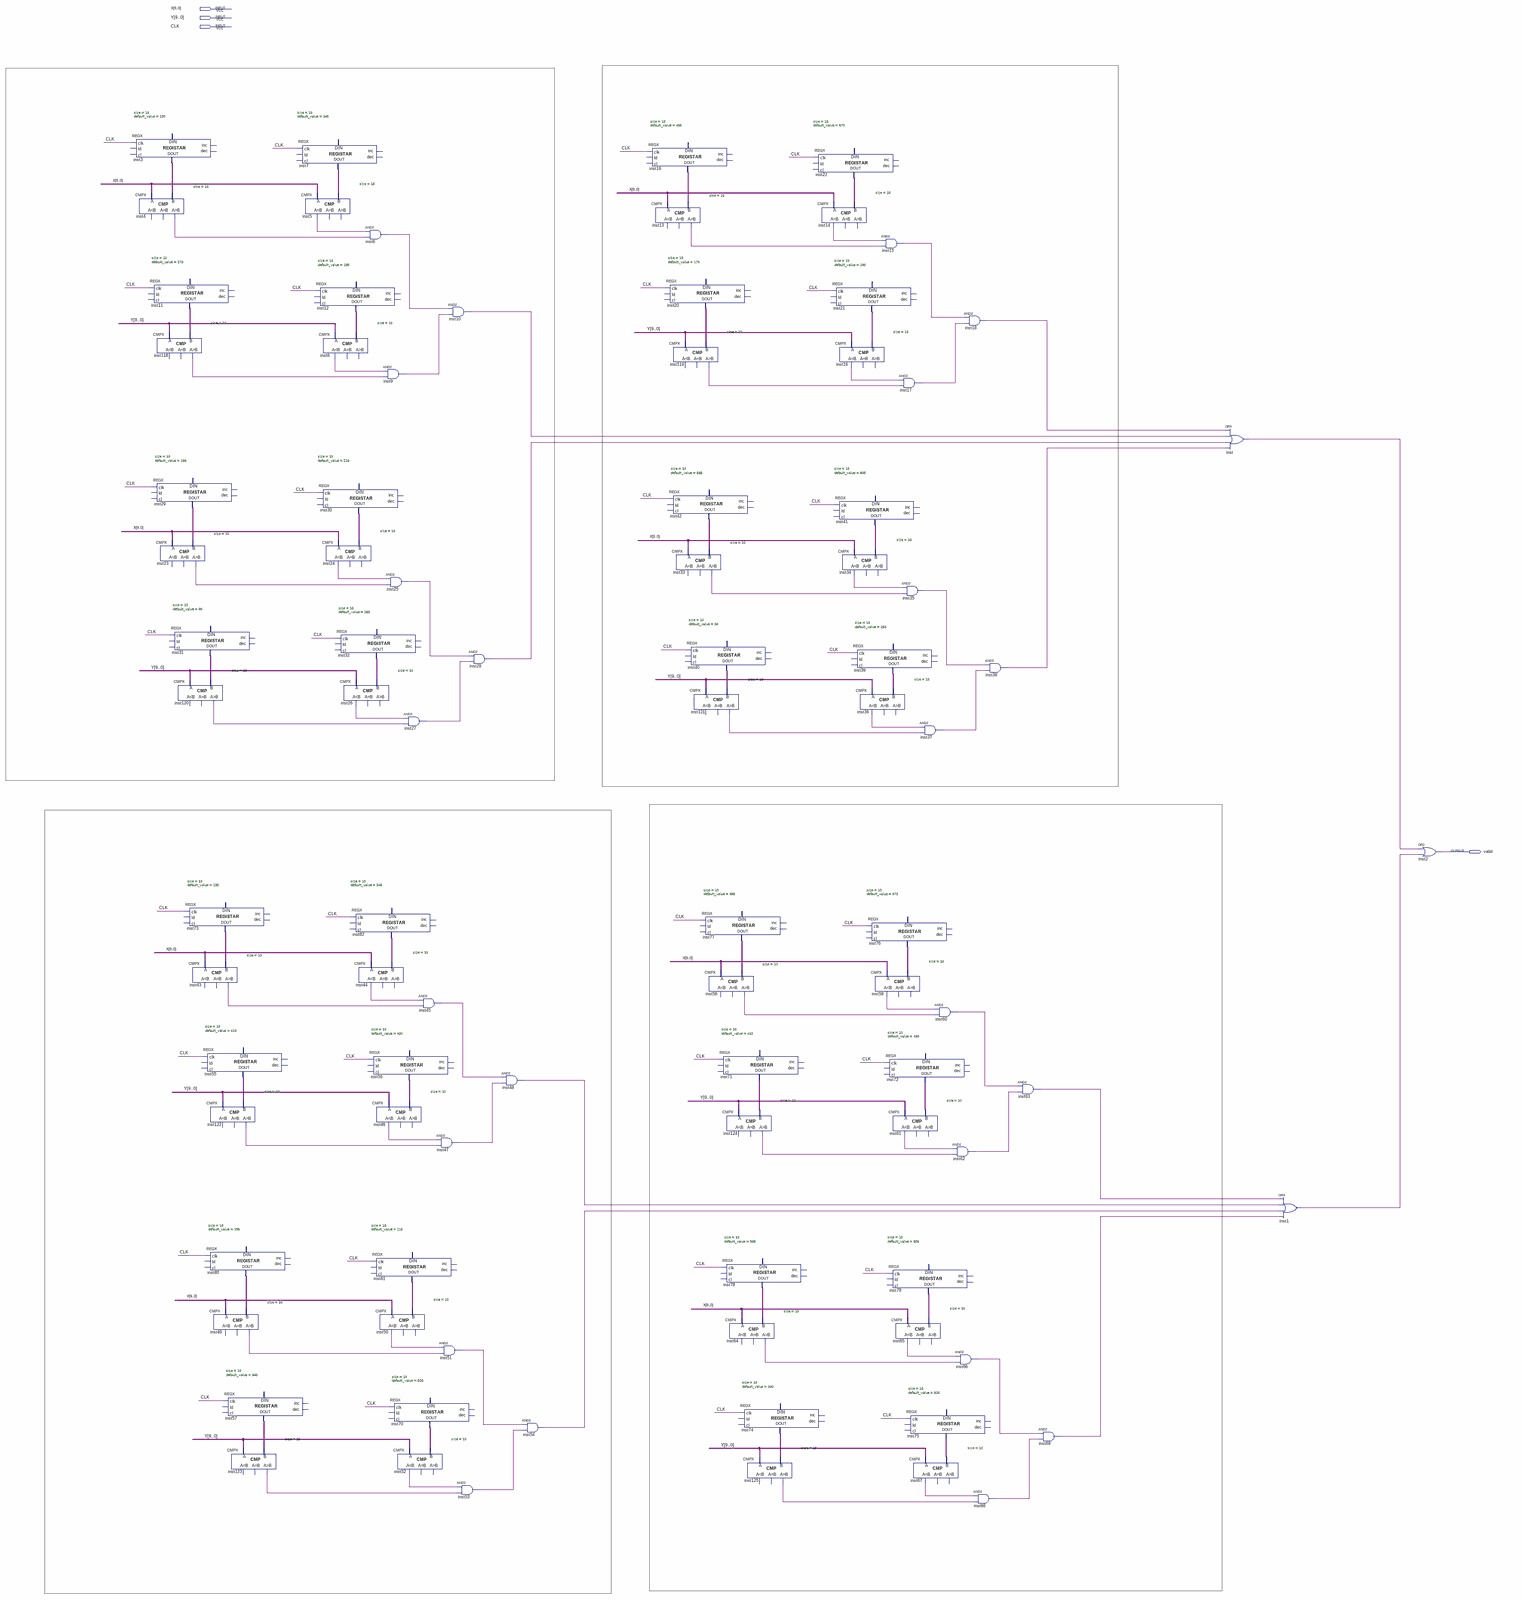
[diagram p0: schematic sheet, whole]
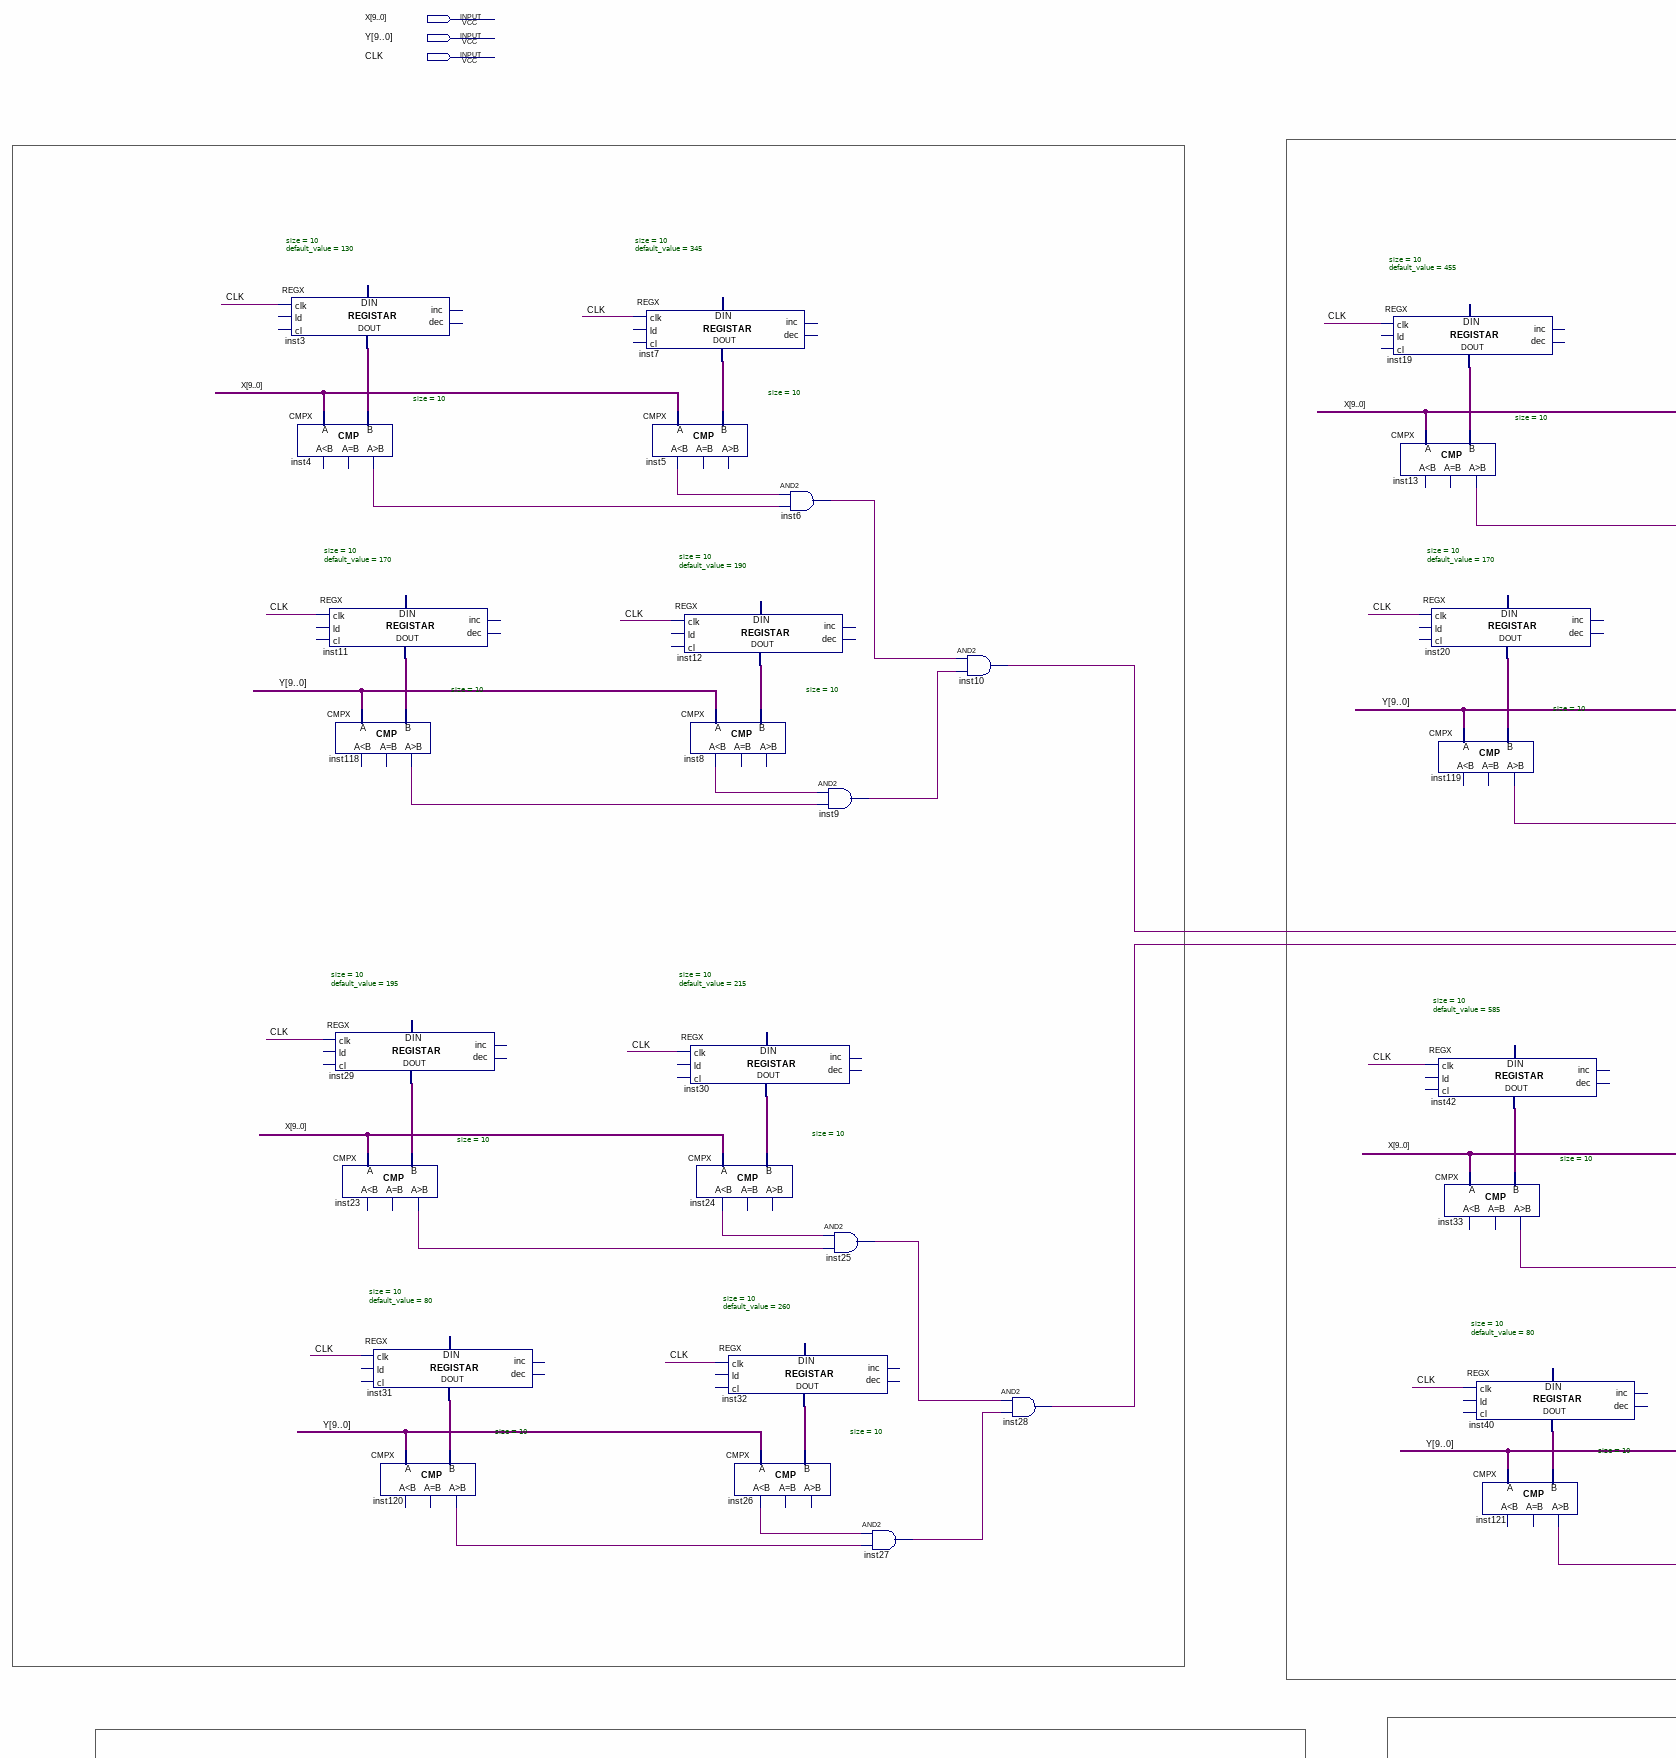
[diagram p1: schematic sheet, upper left part]
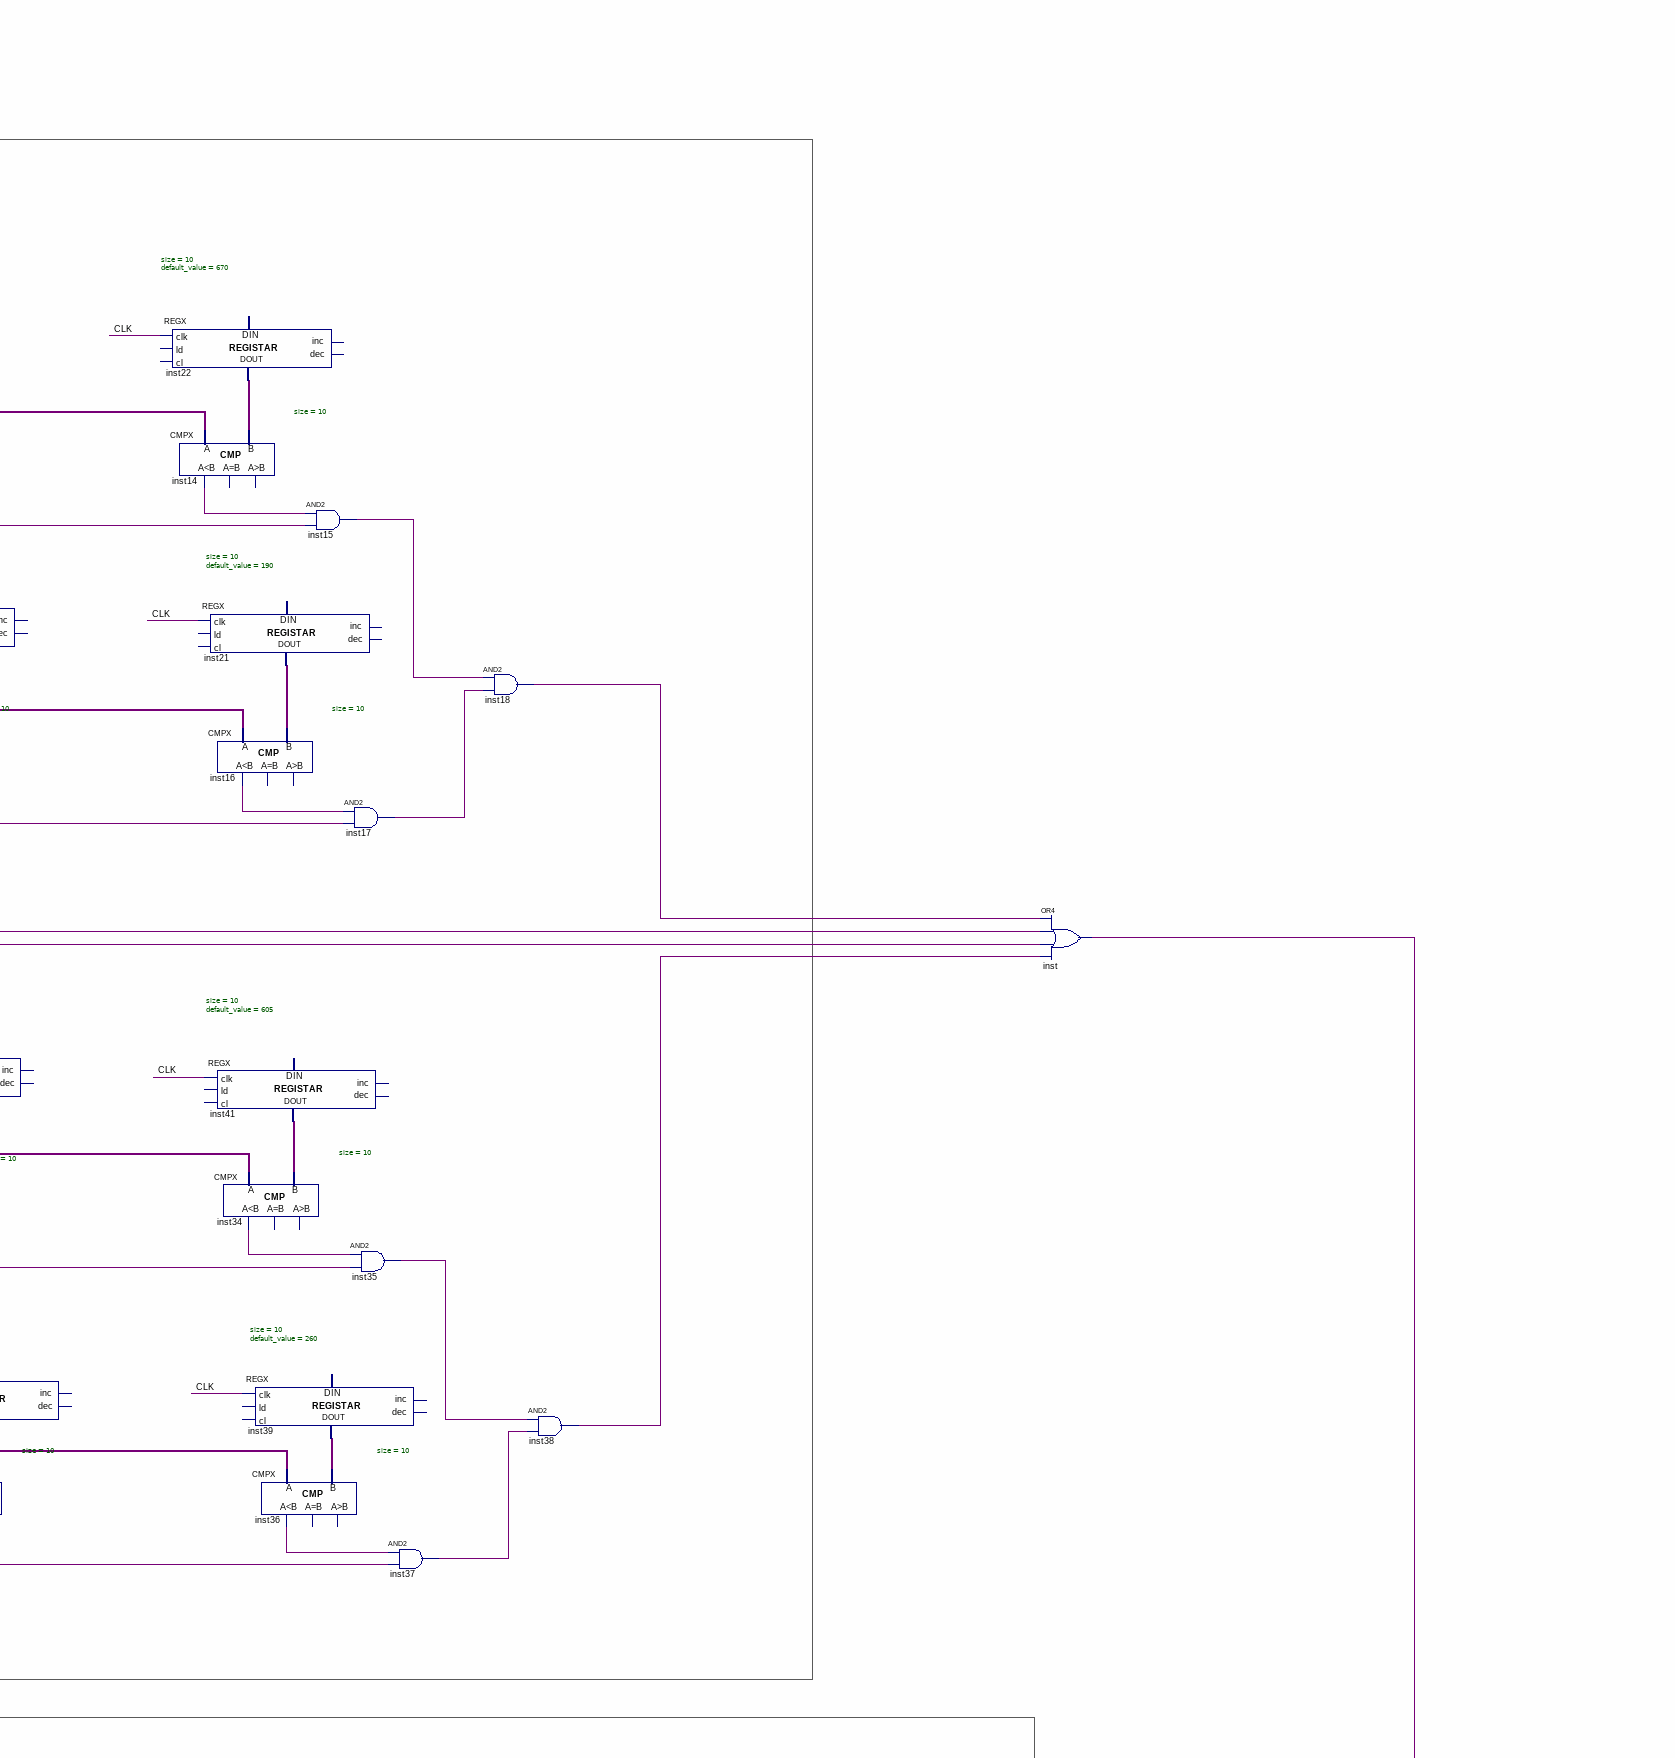
[diagram p2: schematic sheet, upper right part]
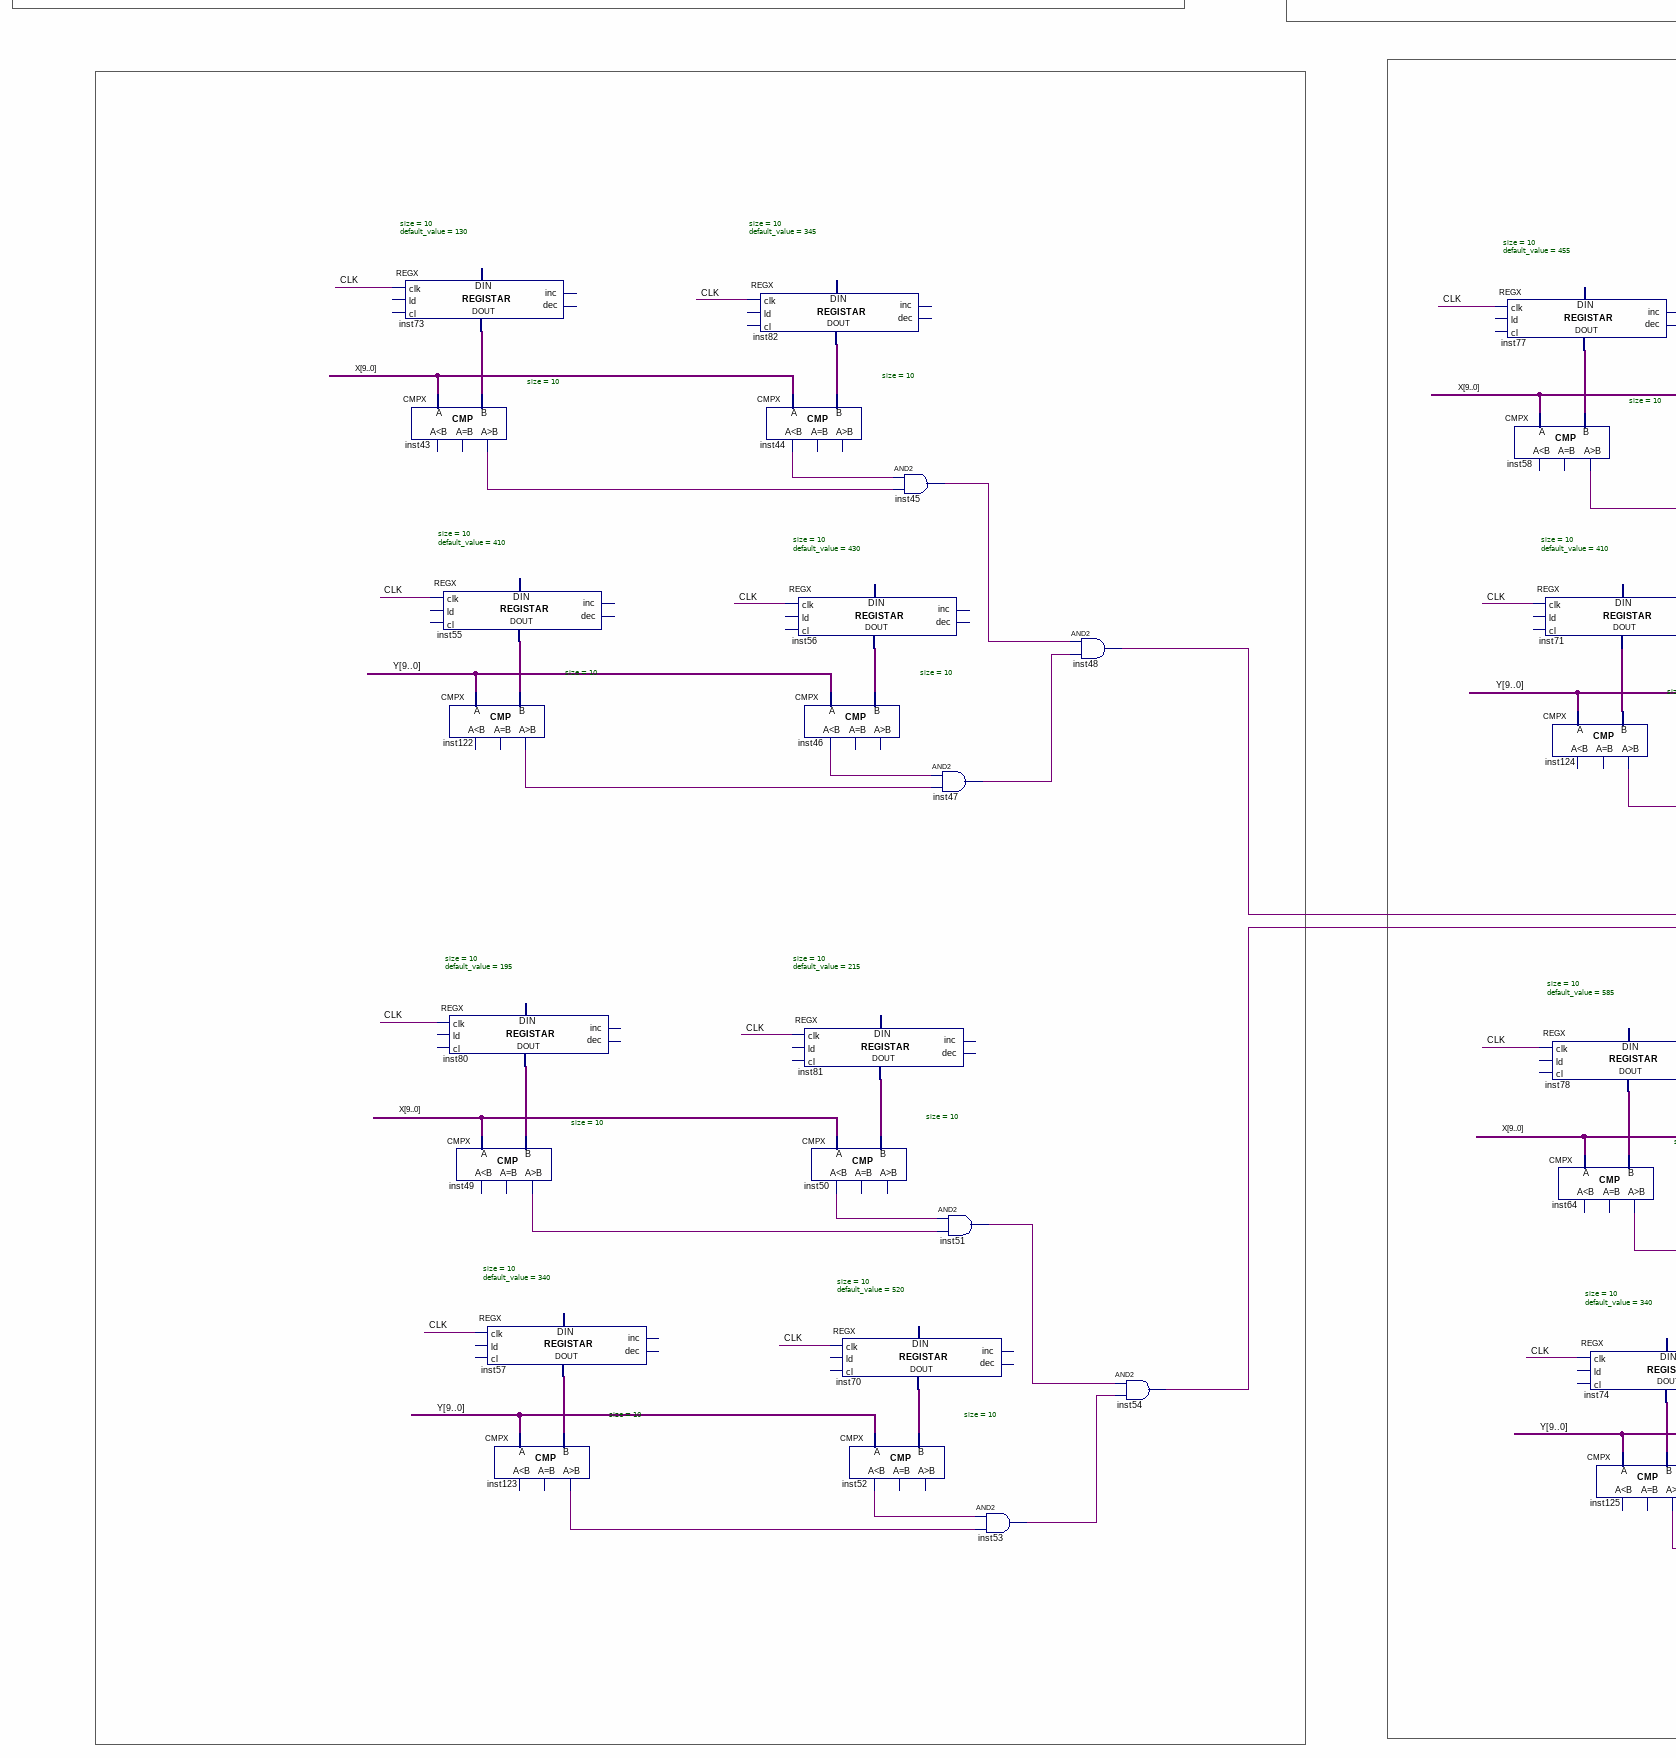
[diagram p3: schematic sheet, lower left part]
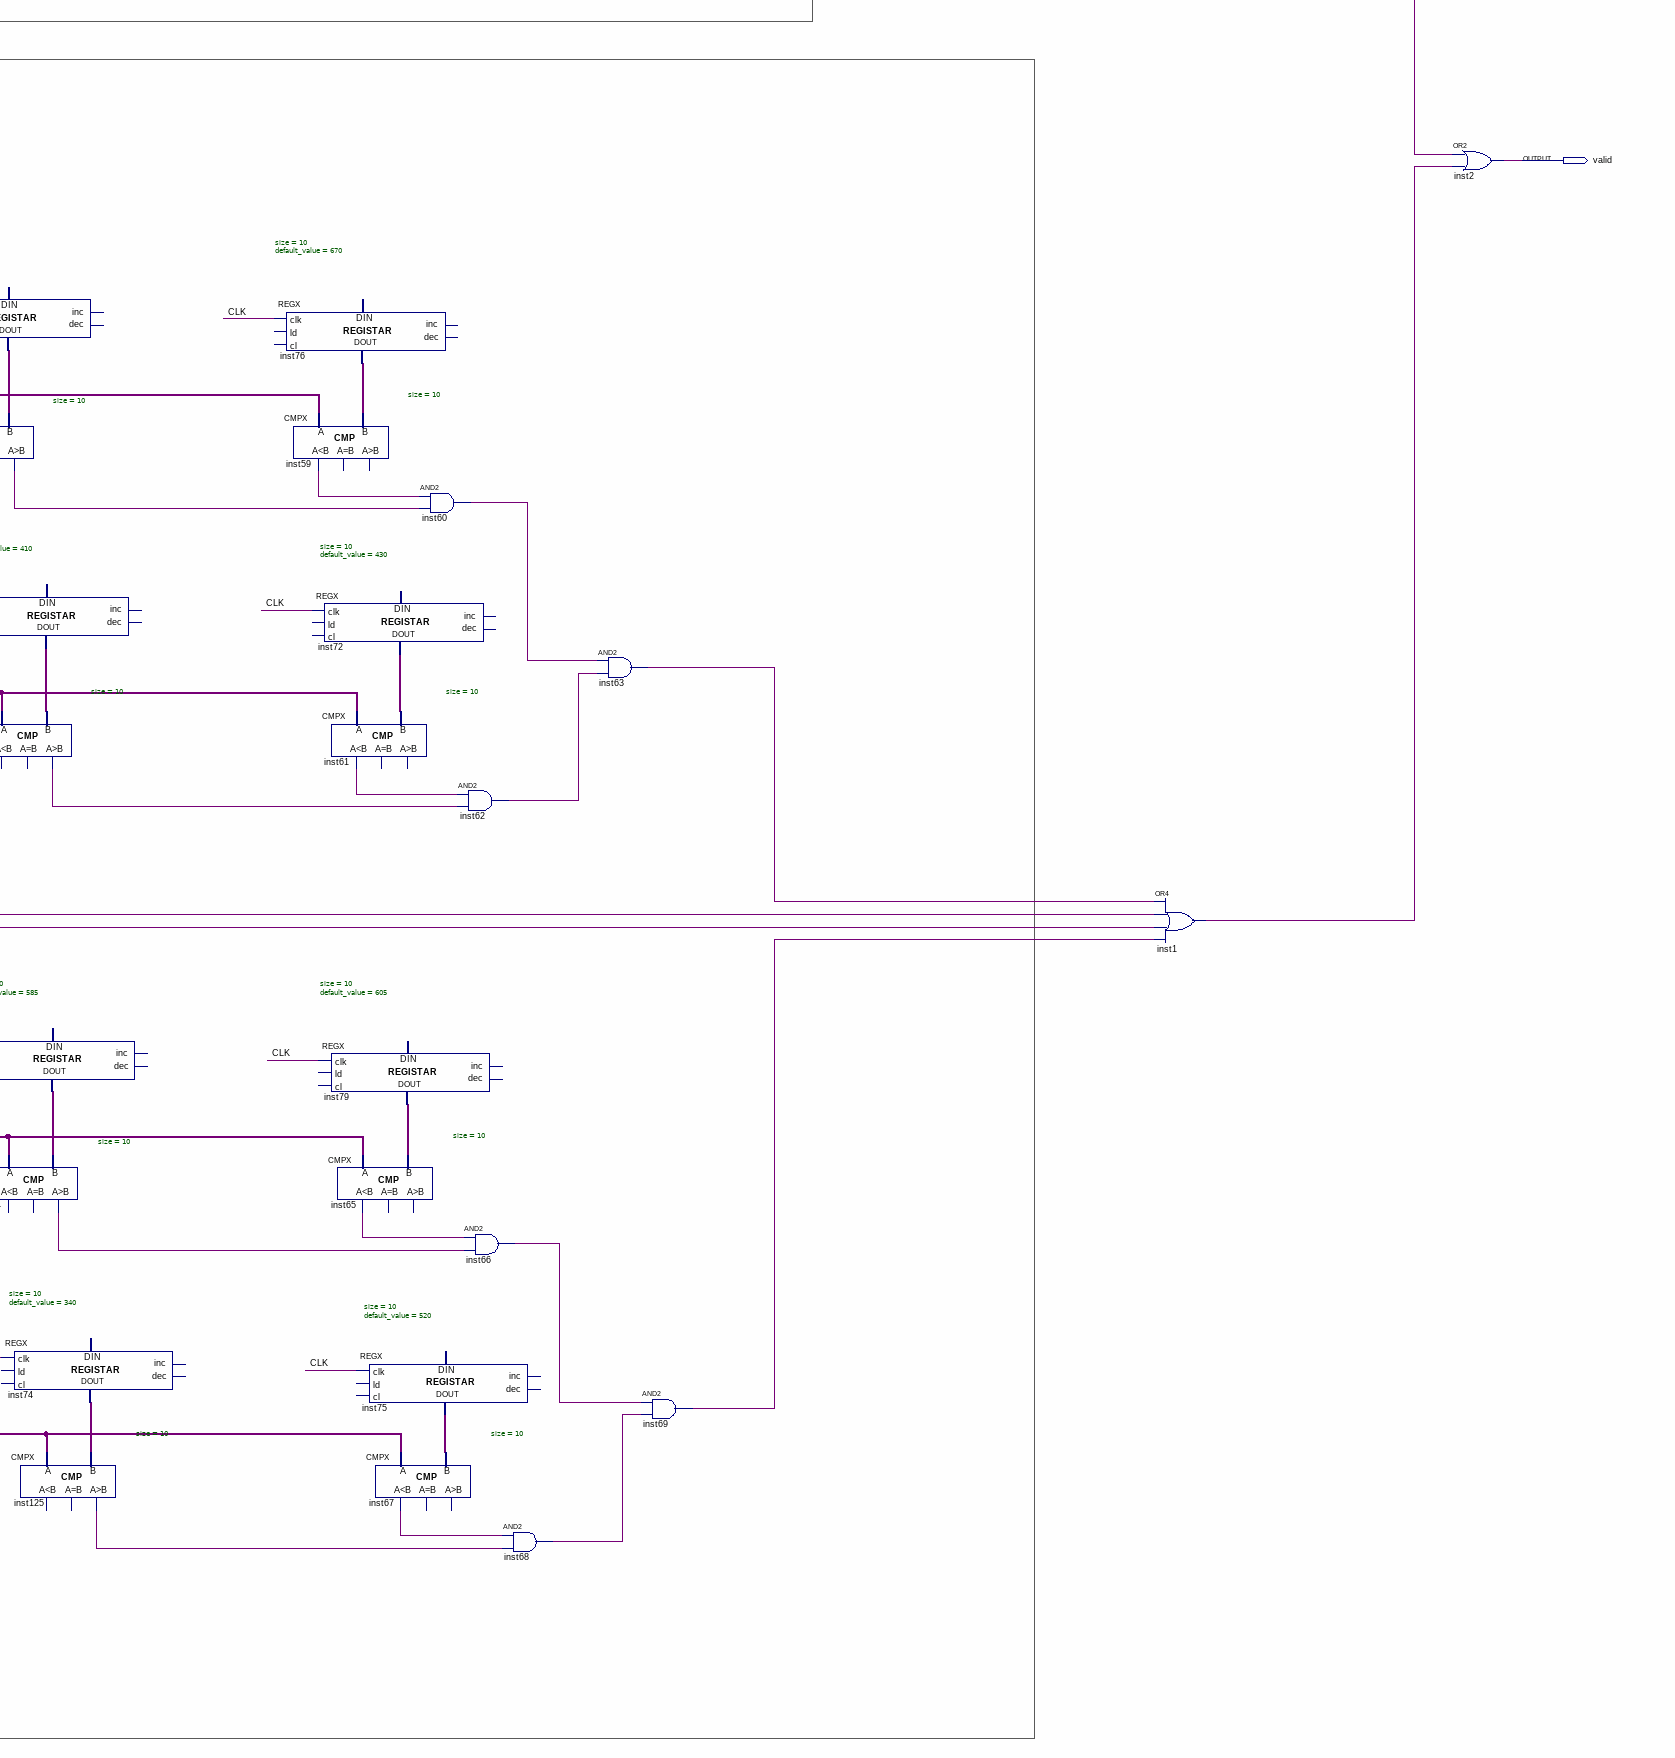
[diagram p4: schematic sheet, lower right part]
// Quartus schematic krst.bdf as structural Verilog: 91 symbols, 4 pins
module krst (
  input  [9:0] X,
  input  [9:0] Y,
  input  CLK,
  output valid
);

  wire inst1_out, inst4_gr, inst5_ls, inst6_out, inst8_ls, inst9_out, inst10_out, inst13_gr, inst14_ls,
       inst15_out, inst16_ls, inst17_out, inst18_out, inst23_gr, inst24_ls, inst25_out, inst26_ls,
       inst27_out, inst28_out, inst33_gr, inst34_ls, inst35_out, inst36_ls, inst37_out, inst38_out,
       inst43_gr, inst44_ls, inst45_out, inst46_ls, inst47_out, inst48_out, inst49_gr, inst50_ls, inst51_out,
       inst52_ls, inst53_out, inst54_out, inst58_gr, inst59_ls, inst60_out, inst61_ls, inst62_out,
       inst63_out, inst64_gr, inst65_ls, inst66_out, inst67_ls, inst68_out, inst69_out, inst118_gr,
       inst119_gr, inst120_gr, inst121_gr, inst122_gr, inst123_gr, inst124_gr, inst125_gr, inst_out;
  wire [9:0] inst3_data_out, inst7_data_out, inst11_data_out, inst12_data_out, inst19_data_out,
       inst20_data_out, inst21_data_out, inst22_data_out, inst29_data_out, inst30_data_out, inst31_data_out,
       inst32_data_out, inst39_data_out, inst40_data_out, inst41_data_out, inst42_data_out, inst55_data_out,
       inst56_data_out, inst57_data_out, inst70_data_out, inst71_data_out, inst72_data_out, inst73_data_out,
       inst74_data_out, inst75_data_out, inst76_data_out, inst77_data_out, inst78_data_out, inst79_data_out,
       inst80_data_out, inst81_data_out, inst82_data_out;

  REGX #(.size(10), .default_value(130)) inst3 (
    .clk(CLK), .data_out(inst3_data_out));  // open: ld, cl, inc, dec, data_in
  CMPX #(.size(10)) inst4 (.A(X), .B(inst3_data_out), .gr(inst4_gr));  // open: ls, eq
  REGX #(.size(10), .default_value(170)) inst11 (
    .clk(CLK), .data_out(inst11_data_out));  // open: ld, cl, inc, dec, data_in
  CMPX #(.size(10)) inst118 (.A(Y), .B(inst11_data_out), .gr(inst118_gr));  // open: ls, eq
  REGX #(.size(10), .default_value(195)) inst29 (
    .clk(CLK), .data_out(inst29_data_out));  // open: ld, cl, inc, dec, data_in
  CMPX #(.size(10)) inst23 (.A(X), .B(inst29_data_out), .gr(inst23_gr));  // open: ls, eq
  REGX #(.size(10), .default_value(80)) inst31 (
    .clk(CLK), .data_out(inst31_data_out));  // open: ld, cl, inc, dec, data_in
  CMPX #(.size(10)) inst120 (.A(Y), .B(inst31_data_out), .gr(inst120_gr));  // open: ls, eq
  REGX #(.size(10), .default_value(130)) inst73 (
    .clk(CLK), .data_out(inst73_data_out));  // open: ld, cl, inc, dec, data_in
  CMPX #(.size(10)) inst43 (.A(X), .B(inst73_data_out), .gr(inst43_gr));  // open: ls, eq
  REGX #(.size(10), .default_value(410)) inst55 (
    .clk(CLK), .data_out(inst55_data_out));  // open: ld, cl, inc, dec, data_in
  CMPX #(.size(10)) inst122 (.A(Y), .B(inst55_data_out), .gr(inst122_gr));  // open: ls, eq
  REGX #(.size(10), .default_value(195)) inst80 (
    .clk(CLK), .data_out(inst80_data_out));  // open: ld, cl, inc, dec, data_in
  CMPX #(.size(10)) inst49 (.A(X), .B(inst80_data_out), .gr(inst49_gr));  // open: ls, eq
  REGX #(.size(10), .default_value(340)) inst57 (
    .clk(CLK), .data_out(inst57_data_out));  // open: ld, cl, inc, dec, data_in
  CMPX #(.size(10)) inst123 (.A(Y), .B(inst57_data_out), .gr(inst123_gr));  // open: ls, eq
  REGX #(.size(10), .default_value(345)) inst7 (
    .clk(CLK), .data_out(inst7_data_out));  // open: ld, cl, inc, dec, data_in
  CMPX #(.size(10)) inst5 (.A(X), .B(inst7_data_out), .ls(inst5_ls));  // open: eq, gr
  REGX #(.size(10), .default_value(190)) inst12 (
    .clk(CLK), .data_out(inst12_data_out));  // open: ld, cl, inc, dec, data_in
  CMPX #(.size(10)) inst8 (.A(Y), .B(inst12_data_out), .ls(inst8_ls));  // open: eq, gr
  REGX #(.size(10), .default_value(215)) inst30 (
    .clk(CLK), .data_out(inst30_data_out));  // open: ld, cl, inc, dec, data_in
  CMPX #(.size(10)) inst24 (.A(X), .B(inst30_data_out), .ls(inst24_ls));  // open: eq, gr
  REGX #(.size(10), .default_value(260)) inst32 (
    .clk(CLK), .data_out(inst32_data_out));  // open: ld, cl, inc, dec, data_in
  CMPX #(.size(10)) inst26 (.A(Y), .B(inst32_data_out), .ls(inst26_ls));  // open: eq, gr
  REGX #(.size(10), .default_value(345)) inst82 (
    .clk(CLK), .data_out(inst82_data_out));  // open: ld, cl, inc, dec, data_in
  CMPX #(.size(10)) inst44 (.A(X), .B(inst82_data_out), .ls(inst44_ls));  // open: eq, gr
  and inst6 (inst6_out, inst5_ls, inst4_gr);
  and inst9 (inst9_out, inst8_ls, inst118_gr);
  REGX #(.size(10), .default_value(430)) inst56 (
    .clk(CLK), .data_out(inst56_data_out));  // open: ld, cl, inc, dec, data_in
  CMPX #(.size(10)) inst46 (.A(Y), .B(inst56_data_out), .ls(inst46_ls));  // open: eq, gr
  REGX #(.size(10), .default_value(215)) inst81 (
    .clk(CLK), .data_out(inst81_data_out));  // open: ld, cl, inc, dec, data_in
  CMPX #(.size(10)) inst50 (.A(X), .B(inst81_data_out), .ls(inst50_ls));  // open: eq, gr
  and inst25 (inst25_out, inst24_ls, inst23_gr);
  and inst27 (inst27_out, inst26_ls, inst120_gr);
  REGX #(.size(10), .default_value(520)) inst70 (
    .clk(CLK), .data_out(inst70_data_out));  // open: ld, cl, inc, dec, data_in
  CMPX #(.size(10)) inst52 (.A(Y), .B(inst70_data_out), .ls(inst52_ls));  // open: eq, gr
  and inst45 (inst45_out, inst44_ls, inst43_gr);
  and inst10 (inst10_out, inst6_out, inst9_out);
  and inst47 (inst47_out, inst46_ls, inst122_gr);
  and inst51 (inst51_out, inst50_ls, inst49_gr);
  and inst28 (inst28_out, inst25_out, inst27_out);
  and inst53 (inst53_out, inst52_ls, inst123_gr);
  and inst48 (inst48_out, inst45_out, inst47_out);
  and inst54 (inst54_out, inst51_out, inst53_out);
  REGX #(.size(10), .default_value(455)) inst19 (
    .clk(CLK), .data_out(inst19_data_out));  // open: ld, cl, inc, dec, data_in
  CMPX #(.size(10)) inst13 (.A(X), .B(inst19_data_out), .gr(inst13_gr));  // open: ls, eq
  REGX #(.size(10), .default_value(170)) inst20 (
    .clk(CLK), .data_out(inst20_data_out));  // open: ld, cl, inc, dec, data_in
  CMPX #(.size(10)) inst119 (.A(Y), .B(inst20_data_out), .gr(inst119_gr));  // open: ls, eq
  REGX #(.size(10), .default_value(585)) inst42 (
    .clk(CLK), .data_out(inst42_data_out));  // open: ld, cl, inc, dec, data_in
  CMPX #(.size(10)) inst33 (.A(X), .B(inst42_data_out), .gr(inst33_gr));  // open: ls, eq
  REGX #(.size(10), .default_value(80)) inst40 (
    .clk(CLK), .data_out(inst40_data_out));  // open: ld, cl, inc, dec, data_in
  CMPX #(.size(10)) inst121 (.A(Y), .B(inst40_data_out), .gr(inst121_gr));  // open: ls, eq
  REGX #(.size(10), .default_value(455)) inst77 (
    .clk(CLK), .data_out(inst77_data_out));  // open: ld, cl, inc, dec, data_in
  CMPX #(.size(10)) inst58 (.A(X), .B(inst77_data_out), .gr(inst58_gr));  // open: ls, eq
  REGX #(.size(10), .default_value(410)) inst71 (
    .clk(CLK), .data_out(inst71_data_out));  // open: ld, cl, inc, dec, data_in
  CMPX #(.size(10)) inst124 (.A(Y), .B(inst71_data_out), .gr(inst124_gr));  // open: ls, eq
  REGX #(.size(10), .default_value(585)) inst78 (
    .clk(CLK), .data_out(inst78_data_out));  // open: ld, cl, inc, dec, data_in
  CMPX #(.size(10)) inst64 (.A(X), .B(inst78_data_out), .gr(inst64_gr));  // open: ls, eq
  REGX #(.size(10), .default_value(340)) inst74 (
    .clk(CLK), .data_out(inst74_data_out));  // open: ld, cl, inc, dec, data_in
  CMPX #(.size(10)) inst125 (.A(Y), .B(inst74_data_out), .gr(inst125_gr));  // open: ls, eq
  REGX #(.size(10), .default_value(670)) inst22 (
    .clk(CLK), .data_out(inst22_data_out));  // open: ld, cl, inc, dec, data_in
  CMPX #(.size(10)) inst14 (.A(X), .B(inst22_data_out), .ls(inst14_ls));  // open: eq, gr
  REGX #(.size(10), .default_value(190)) inst21 (
    .clk(CLK), .data_out(inst21_data_out));  // open: ld, cl, inc, dec, data_in
  CMPX #(.size(10)) inst16 (.A(Y), .B(inst21_data_out), .ls(inst16_ls));  // open: eq, gr
  REGX #(.size(10), .default_value(605)) inst41 (
    .clk(CLK), .data_out(inst41_data_out));  // open: ld, cl, inc, dec, data_in
  CMPX #(.size(10)) inst34 (.A(X), .B(inst41_data_out), .ls(inst34_ls));  // open: eq, gr
  REGX #(.size(10), .default_value(260)) inst39 (
    .clk(CLK), .data_out(inst39_data_out));  // open: ld, cl, inc, dec, data_in
  CMPX #(.size(10)) inst36 (.A(Y), .B(inst39_data_out), .ls(inst36_ls));  // open: eq, gr
  and inst15 (inst15_out, inst14_ls, inst13_gr);
  REGX #(.size(10), .default_value(670)) inst76 (
    .clk(CLK), .data_out(inst76_data_out));  // open: ld, cl, inc, dec, data_in
  CMPX #(.size(10)) inst59 (.A(X), .B(inst76_data_out), .ls(inst59_ls));  // open: eq, gr
  and inst17 (inst17_out, inst16_ls, inst119_gr);
  and inst35 (inst35_out, inst34_ls, inst33_gr);
  REGX #(.size(10), .default_value(430)) inst72 (
    .clk(CLK), .data_out(inst72_data_out));  // open: ld, cl, inc, dec, data_in
  CMPX #(.size(10)) inst61 (.A(Y), .B(inst72_data_out), .ls(inst61_ls));  // open: eq, gr
  REGX #(.size(10), .default_value(605)) inst79 (
    .clk(CLK), .data_out(inst79_data_out));  // open: ld, cl, inc, dec, data_in
  CMPX #(.size(10)) inst65 (.A(X), .B(inst79_data_out), .ls(inst65_ls));  // open: eq, gr
  REGX #(.size(10), .default_value(520)) inst75 (
    .clk(CLK), .data_out(inst75_data_out));  // open: ld, cl, inc, dec, data_in
  and inst37 (inst37_out, inst36_ls, inst121_gr);
  CMPX #(.size(10)) inst67 (.A(Y), .B(inst75_data_out), .ls(inst67_ls));  // open: eq, gr
  and inst60 (inst60_out, inst59_ls, inst58_gr);
  and inst62 (inst62_out, inst61_ls, inst124_gr);
  and inst18 (inst18_out, inst15_out, inst17_out);
  and inst66 (inst66_out, inst65_ls, inst64_gr);
  and inst68 (inst68_out, inst67_ls, inst125_gr);
  and inst38 (inst38_out, inst35_out, inst37_out);
  and inst63 (inst63_out, inst60_out, inst62_out);
  and inst69 (inst69_out, inst66_out, inst68_out);
  or inst (inst_out, inst18_out, inst10_out, inst28_out, inst38_out);
  or inst1 (inst1_out, inst63_out, inst48_out, inst54_out, inst69_out);
  or inst2 (valid, inst_out, inst1_out);
endmodule
